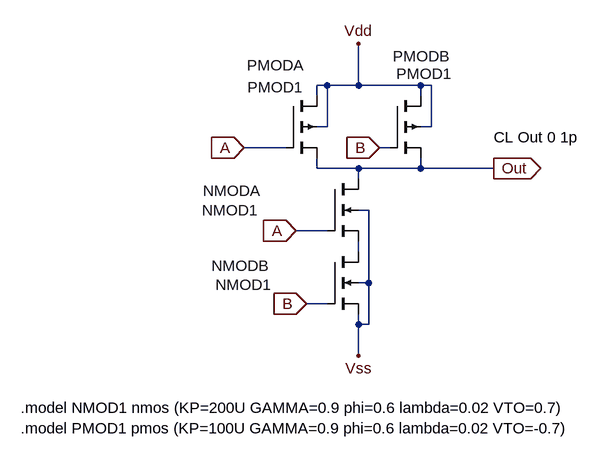
[diagram p0: schematic NAND.asc]
NAND.asc, the LTspice schematic file:
Version 4
SHEET 1 880 680
WIRE 272 -32 256 -32
WIRE 320 -32 320 -96
WIRE 320 -32 272 -32
WIRE 416 -32 320 -32
WIRE 432 -32 416 -32
WIRE 256 -16 256 -32
WIRE 416 -16 416 -32
WIRE 272 32 272 -32
WIRE 272 32 256 32
WIRE 432 32 432 -32
WIRE 432 32 416 32
WIRE 208 64 144 64
WIRE 368 64 352 64
WIRE 256 96 256 80
WIRE 320 96 256 96
WIRE 416 96 416 80
WIRE 416 96 320 96
WIRE 528 96 416 96
WIRE 320 112 320 96
WIRE 336 160 320 160
WIRE 272 192 224 192
WIRE 320 224 320 208
WIRE 336 272 336 160
WIRE 336 272 320 272
WIRE 272 304 240 304
WIRE 320 336 320 320
WIRE 336 336 336 272
WIRE 336 336 320 336
WIRE 320 384 320 336
FLAG 144 64 A
IOPIN 144 64 In
FLAG 224 192 A
IOPIN 224 192 In
FLAG 352 64 B
IOPIN 352 64 In
FLAG 240 304 B
IOPIN 240 304 In
FLAG 528 96 Out
IOPIN 528 96 Out
FLAG 320 384 Vss
FLAG 320 -96 Vdd
SYMBOL pmos4 208 -16 R0
WINDOW 0 -60 -47 Left 2
WINDOW 3 -59 -13 Left 2
SYMATTR InstName PMODA
SYMATTR Value PMOD1
SYMATTR Value2 l=1u w=50u
SYMBOL pmos4 368 -16 R0
WINDOW 0 5 -61 Left 2
WINDOW 3 10 -34 Left 2
SYMATTR InstName PMODB
SYMATTR Value PMOD1
SYMATTR Value2 l=1u w=50u
SYMBOL nmos4 272 112 R0
WINDOW 0 -191 18 Left 2
WINDOW 3 -193 48 Left 2
SYMATTR InstName NMODA
SYMATTR Value NMOD1
SYMATTR Value2 l=1u w=50u
SYMBOL nmos4 272 224 R0
WINDOW 0 -178 22 Left 2
WINDOW 3 -172 51 Left 2
SYMATTR InstName NMODB
SYMATTR Value NMOD1
SYMATTR Value2 l=1u w=100u
TEXT -200 464 Left 2 !.model NMOD1 nmos (KP=200U GAMMA=0.9 phi=0.6 lambda=0.02 VTO=0.7)
TEXT -200 496 Left 2 !.model PMOD1 pmos (KP=100U GAMMA=0.9 phi=0.6 lambda=0.02 VTO=-0.7)
TEXT 528 48 Left 2 !CL Out 0 1p

The netlist it stands for:
* NAND.asc
M§PMODA Vdd A Out Vdd PMOD1 l=1u w=50u
M§PMODB Vdd B Out Vdd PMOD1 l=1u w=50u
M§NMODA Out A N001 Vss NMOD1 l=1u w=50u
M§NMODB N001 B Vss Vss NMOD1 l=1u w=100u
.model NMOS NMOS
.model PMOS PMOS
.lib standard.mos
.model NMOD1 nmos (KP=200U GAMMA=0.9 phi=0.6 lambda=0.02 VTO=0.7)
.model PMOD1 pmos (KP=100U GAMMA=0.9 phi=0.6 lambda=0.02 VTO=-0.7)
CL Out 0 1p
.backanno
.end